# Altium schematic sheet UNOshield.SchDoc
size A4; SPICEModelCacheCSOAAMCO: <root> / <DocumentId>CSOAAMCO</DocumentId> / </root>
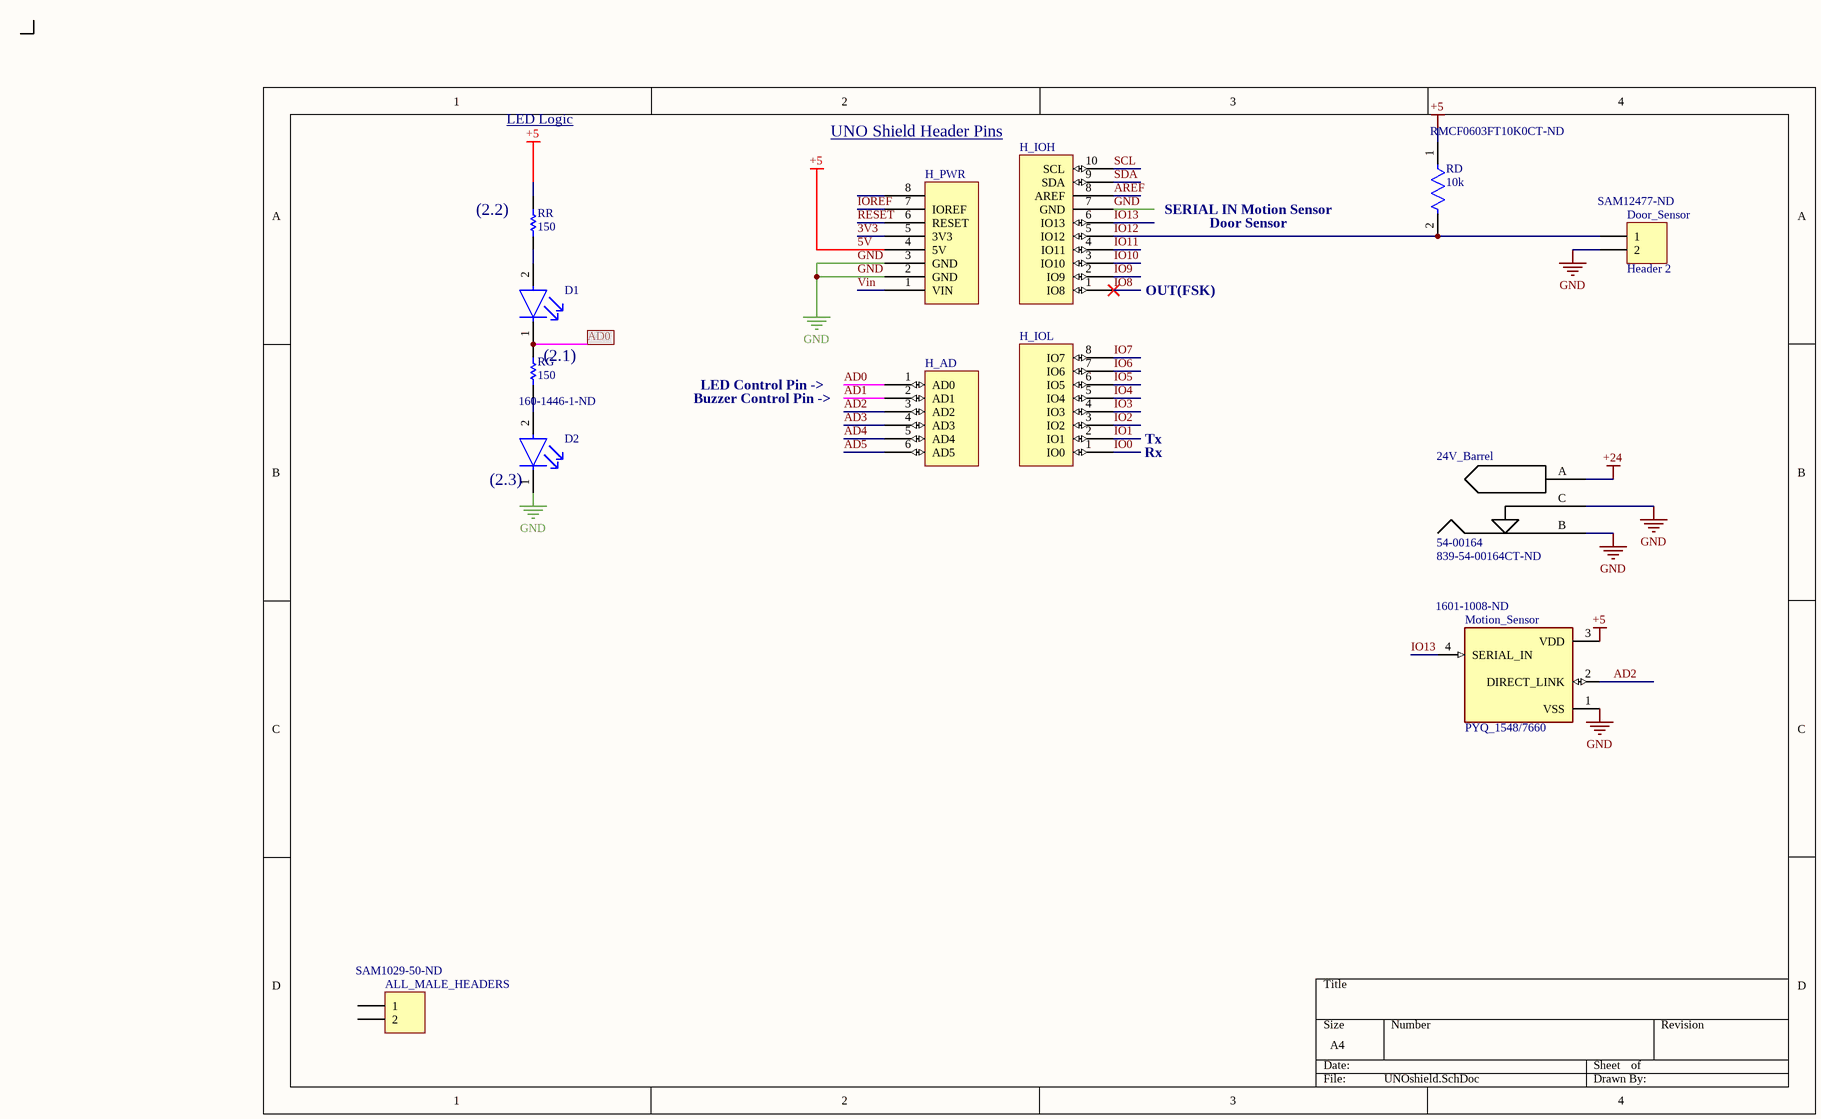
[diagram p0: UNOshield.SchDoc]

## Parts
24V_Barrel  54-00164  Supplier Part Number 1: 839-54-00164CT-ND  [54-00164]
ALL_MALE_HEADERS  Supplier Part Number 1: SAM1029-50-ND  [HDR1X2]  (mechanical)
D1  LS R976-NR-1  [FP-LS_R976-MFG]  (value not drawn)
D2  Supplier Part Number 1: 160-1446-1-ND  [FP-LTST-C191KGKT-MFG]  (hidden comment: LTST-C191KGKT)
Door_Sensor  Header 2  Supplier Part Number 1: SAM12477-ND  [HDR1X2]
H_AD  AD  [Header 6x1 8.5mm]  (value not drawn)
H_IOH  IOH  [Header 10x1 8.5mm]  (value not drawn)
H_IOL  IOL  [Header 8x1 8.5mm]  (value not drawn)
H_PWR  POWER_UNO  [Header 8x1 8.5mm]  (value not drawn)
Motion_Sensor  PYQ_1548/7660  Supplier Part Number 1: 1601-1008-ND  [TO254P940H440-4]
RD  10k  Supplier Part Number 1: RMCF0603FT10K0CT-ND  [FP-RC0603-0_55-IPC_C]
RG  value 150  [C0805]  (hidden comment: Res1)
RR  value 150  [C0805]  (hidden comment: Res1)

## Nets
5V: H_PWR.4(5V) Motion_Sensor.3(VDD) RD.1 RR.2  [also labelled +5]
+24: 24V_Barrel.A(Pin/Center)
GND: 24V_Barrel.B 24V_Barrel.C(Sheath/Outer) D2.1(C) Door_Sensor.2 H_IOH.7(GND) H_PWR.2(GND) H_PWR.3(GND) Motion_Sensor.1(VSS)
3V3: H_PWR.5(3V3)
AD0: D1.1(C) H_AD.1(AD0) RG.2
AD1: H_AD.2(AD1)
AD2: H_AD.3(AD2) Motion_Sensor.2(DIRECT_LINK)
AD3: H_AD.4(AD3)
AD4: H_AD.5(AD4)
AD5: H_AD.6(AD5)
AREF: H_IOH.8(AREF)
IO0: H_IOL.1(IO0)
IO1: H_IOL.2(IO1)
IO2: H_IOL.3(IO2)
IO3: H_IOL.4(IO3)
IO4: H_IOL.5(IO4)
IO5: H_IOL.6(IO5)
IO6: H_IOL.7(IO6)
IO7: H_IOL.8(IO7)
IO8: H_IOH.1(IO8)
IO9: H_IOH.2(IO9)
IO10: H_IOH.3(IO10)
IO11: H_IOH.4(IO11)
IO12: Door_Sensor.1 H_IOH.5(IO12) RD.2
IO13: H_IOH.6(IO13) Motion_Sensor.4(SERIAL_IN)
IOREF: H_PWR.7(IOREF)
RESET: H_PWR.6(RESET)
SCL: H_IOH.10(SCL)
SDA: H_IOH.9(SDA)
Vin: H_PWR.1(VIN)
NetD1_2: D1.2(A) RR.1
NetD2_2: D2.2(A) RG.1

Not connected (* = marked no-connect by the designer): ALL_MALE_HEADERS 1 2; H_PWR 8

## Notes on the sheet
- LED Logic
- UNO Shield Header Pins
- (near RR) (2.2)
- SERIAL IN Motion Sensor
- Door Sensor
- OUT(FSK)
- (near RG) (2.1)
- LED Control Pin ->
- Buzzer Control Pin ->
- Rx
- Tx
- (near D2) (2.3)

## Library data of the parts
24V_Barrel = 54-00164: Power Barrel Connector Jack 2.10mm ID (0.083"), 5.50mm OD (0.217") Surface Mount, Right Angle; Manufacturer: Tensility; Supplier 1: Digikey; Manufacturer Part Number: 54-00164; RoHS: No; Category: Connectors; Stock 1: 4776; Pricing 1: 1=0.86, 10=0.73, 25=0.684, 50=0.6514, 100=0.6202 (USD); ComponentLink1URL: http://www.tensility.com/pdffiles/54-00164.pdf?src-supplier=Digikey; ComponentLink1Description: http://www.tensility.com/pdffiles/54-00164.pdf?src-supplier=Digikey; ComponentLink2URL: https://datasheet.octopart.com/54-00164-Tensility-datasheet-189118339.pdf?src-supplier=Master+Electronics; ComponentLink2Description: https://datasheet.octopart.com/54-00164-Tensility-datasheet-189118339.pdf?src-supplier=Master+Electronics
ALL_MALE_HEADERS = Header 2: Board Connector, 50 Contact(s), 1 Row(s), Male, Straight, 0.1 inch Pitch, Solder Terminal, Black Insulator, Receptacle; Manufacturer: Samtec; Manufacturer Part Number: TSW-150-07-G-S; Option: General Purpose; Contact Pattern: RECTANGULAR; Contact Style: SQ PIN-SKT; Filter Feature: No; Number Of Connectors: 1; Number of Contacts: 50; Plating Thickness: 10uin; Reference Standard: UL; Reliability: COMMERCIAL; Supplier 1: Digikey; RoHS: Yes; Category: Connectors; Stock 1: 9225; Pricing 1: 1=2.96, 25=2.8564, 50=2.7206, 100=2.5281, 500=2.08774, 1000=1.74274, 2500=1.4559, 5000=1.18715 (USD); Mounting Technology: Board; Contact Material: Bronze; Contact Finish - Mating: GOLD (10); Contact Finish - Termination: Gold (Au) - with Nickel (Ni) barrier; Insulation Color: Black; Insulation Material: Glass; Connector Type: BOARD CONNECTOR; JESD-609 Code: e4; Body/Shell Style: RECEPTACLE; Contact Gender: Male; Mixed Contacts: No; Mounting Style: STRAIGHT; Number Of PCB Rows: 1; Number of Rows Loaded: 1; PCB Contact Pattern: RECTANGULAR; Termination: Solder; Body Breadth: 0.1inch; Body Depth: 0.1inch; Mating Contact Pitch: 0.1inch; Terminal Length: 0.1inch; Terminal Pitch: 2.54mm; Flammability Rating: UL94 V-0; DIN Conformance: No; IEC Conformance: No; MIL Conformance: No; Reach SVHC Compliant: Yes; RoHS Compliant: Yes; ComponentLink1URL: https://datasheet.ciiva.com:443/pdfs/VipMasterIC/IC/SAMI/SAMI-S-A0002522030/SAMI-S-A0002522030-1.pdf?src-supplier=IHS+Markit; ComponentLink1Description: https://datasheet.ciiva.com:443/pdfs/VipMasterIC/IC/SAMI/SAMI-S-A0002522030/SAMI-S-A0002522030-1.pdf?src-supplier=IHS+Markit; ComponentLink2URL: https://datasheet.ciiva.com/711/tsw-xxx-xx-xxx-x-xx-xxx-mkt-711590.pdf?src-supplier=Digikey; ComponentLink2Description: https://datasheet.ciiva.com/711/tsw-xxx-xx-xxx-x-xx-xxx-mkt-711590.pdf?src-supplier=Digikey; ComponentLink3URL: https://datasheet.ciiva.com/9712/htsw-th-9712215.pdf?src-supplier=Avnet; ComponentLink3Description: https://datasheet.ciiva.com/9712/htsw-th-9712215.pdf?src-supplier=Avnet
D1 = CMP-62016-000037-1: LED RED DIFFUSED 0805 SMD; Lens Size: 1.25mm; Number of LEDs: 1; Luminous Intensity: 180mcd; Dominant Wavelength: 633nm; Lens Style: Flat; Reverse Voltage: 12V; Lens Color: White; Forward Voltage: 2.5V; Forward Current: 25mA; Power Dissipation: 65W; Luminous Flux: 0.47lm; Test Current: 20mA; Viewing Angle: 160°; Length: 2mm; Number of Pins: 2; Lens Transparency: Diffused; Min Operating Temperature: -30°C; Case Code (Metric): 2012; Depth: 1.35mm; Color: Red; Illumination Color: Red; Max Operating Temperature: 85°C; Mount: Surface Mount; Case/Package: 0805; Height: 0.9mm; Package Quantity: 16000; Number of Elements: 1; Radiation Hardening: No; Case Code (Imperial): 0805; Packaging: Tape and Reel; Width: 1.25mm; Supplier 1: Digi-Key; Supplier Part Number 1: 475-LSR976-NR-1CT-ND
D2 = CMP-2000-05198-4: NexarPartId: 549907; Manufacturer: Vishay Lite-On; Forward Voltage: 2V; Viewing Angle: 130°; Lens Transparency: Clear; Power Rating: 75mW; Number of LEDs: 1; Luminous Intensity: 35mcd; Forward Current: 20mA; Dominant Wavelength: 571nm; Illumination Color: Green; Lens Color: Clear, Colorless; Reverse Voltage: 5V; Wavelength: 574nm; Description: Single Color LED, Ultra Bright Green, Water Clear, 1.1mm; Shape: Rectangular; Optoelectronic Device Type: SINGLE COLOR LED; Overall Height: 0.55mm; Number of Pins: 2; Packaging: Tape and Reel; Number of Elements: 1; Schedule B: 8541402000, 8541402000; Height: 550µm; Case/Package: 0603; Depth: 800µm; Max Operating Temperature: 85°C; RoHS: Compliant; Lens Style: Clear; Lead Free: Lead Free; Length: 1.6mm; Mount: Surface Mount; Test Current: 20mA; Width: 800µm; Case Code (Imperial): 0603; Min Operating Temperature: -55°C; Case Code (Metric): 1608; Radiation Hardening: No; Power Dissipation: 75mW; Color: Green; Supplier 1: Digikey; Manufacturer Part Number: LTST-C191KGKT; Stock 1: 1206866; Pricing 1: 1=0.15, 10=0.1, 100=0.0688, 500=0.05448, 1000=0.04972, 2000=0.04564, 5000=0.04116, 10000=0.03835, 15000=0.0369, 25000=0.03527, 35000=0.03429, 50000=0.03334, 125000=0.03124, 250000=0.02993 (USD); Mounting Technology: Surface Mount; Pins: 2; Color@wavelength: Green; Terminal Finish: Tin; JESD-609 Code: e3; Luminous Intensity-Nom: 35mcd; Channels: 1; Reverse Voltage-Max: 5V; Size: 1.1mm; Terminal Pitch: 1.5mm; Reach SVHC Compliant: Yes; RoHS Compliant: Yes; ComponentLink1URL: https://datasheet.ciiva.com:443/pdfs/VipMasterIC/IC/LITE/LITE-S-A0003156116/LITE-S-A0003156116-1.pdf?src-supplier=IHS+Markit; ComponentLink1Description: https://datasheet.ciiva.com:443/pdfs/VipMasterIC/IC/LITE/LITE-S-A0003156116/LITE-S-A0003156116-1.pdf?src-supplier=IHS+Markit; ComponentLink2URL: https://datasheet.ciiva.com/2109/ltst-c191kgkt-2109973.pdf?src-supplier=Digikey; ComponentLink2Description: https://datasheet.ciiva.com/2109/ltst-c191kgkt-2109973.pdf?src-supplier=Digikey
Door_Sensor = Header 2: Board Connector, 2 Contact(s), 1 Row(s), Female, Straight, 0.1 inch Pitch, Solder Terminal, Black Insulator, Socket; Manufacturer: Samtec; Manufacturer Part Number: CES-102-01-G-S; Option: General Purpose; Additional Feature: Low Profile; Contact Pattern: RECTANGULAR; Contact Resistance: 10mR; Contact Style: SQ PIN-SKT; Filter Feature: No; Insertion Force-Max: 2.224N; Mating Information: MULTIPLE MATING PARTS AVAILABLE; Number Of Connectors: 1; Polarization Key: POLARIZED HOUSING; Rated Current (Signal): 1A; Number of Contacts: 2; Withdrawl Force-Min: 1.112N; Body Breadth: 0.12inch; Body Depth: 0.2inch; Plating Thickness: 20uin; Reference Standard: UL; Reliability: COMMERCIAL; LatestRevisionDate: 17-Jul-2002; LatestRevisionNote: Re-released for DXP Platform.; Publisher: Altium Limited; Supplier 1: Digikey; RoHS: Yes; Category: Connectors; Stock 1: 5771; Pricing 1: 1=0.39, 10=0.329, 100=0.2797, 500=0.24966, 1000=0.23774, 5000=0.21221, 10000=0.20208 (USD); Mounting Technology: Board; Contact Finish - Mating: GOLD (30); Contact Finish - Termination: Gold (Au) - with Nickel (Ni) barrier; Insulation Color: Black; Insulation Material: Glass; Min Operating Temperature: -65°C; Max Operating Temperature: 125°C; Connector Type: BOARD CONNECTOR; JESD-609 Code: e4; Body/Shell Style: SOCKET; Contact Gender: Female; Mixed Contacts: No; Mounting Style: STRAIGHT; Number Of PCB Rows: 1; Number of Rows Loaded: 1; PCB Contact Pattern: RECTANGULAR; Termination: Solder; Body Length: 0.2inch; Mating Contact Pitch: 0.1inch; Terminal Length: 0.12inch; Terminal Pitch: 2.54mm; Flammability Rating: UL94 V-0; DIN Conformance: No; IEC Conformance: No; MIL Conformance: No; Reach SVHC Compliant: Yes; RoHS Compliant: Yes; ComponentLink1URL: https://datasheet.ciiva.com:443/pdfs/VipMasterIC/IC/SAMI/SAMI-S-A0000096262/SAMIS23449-1.pdf?src-supplier=IHS+Markit; ComponentLink1Description: https://datasheet.ciiva.com:443/pdfs/VipMasterIC/IC/SAMI/SAMI-S-A0000096262/SAMIS23449-1.pdf?src-supplier=IHS+Markit; ComponentLink2URL: http://www.farnell.com/datasheets/2045624.pdf?src-supplier=Farnell; ComponentLink2Description: http://www.farnell.com/datasheets/2045624.pdf?src-supplier=Farnell; ComponentLink3URL: http://suddendocs.samtec.com/prints/ces-1xx-xx-x-s-xx-mkt.pdf?src-supplier=Digikey; ComponentLink3Description: http://suddendocs.samtec.com/prints/ces-1xx-xx-x-s-xx-mkt.pdf?src-supplier=Digikey; ComponentLink4URL: http://www.samtec.com/documents/webfiles/pdf/CES.pdf?src-supplier=Avnet; ComponentLink4Description: http://www.samtec.com/documents/webfiles/pdf/CES.pdf?src-supplier=Avnet; ComponentLink5URL: https://datasheet.octopart.com/CES-102-01-G-S-Samtec-datasheet-62107104.pdf?src-supplier=Newark; ComponentLink5Description: https://datasheet.octopart.com/CES-102-01-G-S-Samtec-datasheet-62107104.pdf?src-supplier=Newark; ComponentLink6URL: https://datasheet.octopart.com/CES-102-01-G-S-Samtec-datasheet-130012063.pdf?src-supplier=Toby+Electronics; ComponentLink6Description: https://datasheet.octopart.com/CES-102-01-G-S-Samtec-datasheet-130012063.pdf?src-supplier=Toby+Electronics; ComponentLink7URL: https://datasheet.octopart.com/CES-102-01-G-S-Samtec-datasheet-151455179.pdf?src-supplier=Sager+Electronics; ComponentLink7Description: https://datasheet.octopart.com/CES-102-01-G-S-Samtec-datasheet-151455179.pdf?src-supplier=Sager+Electronics
Motion_Sensor = PYQ_1548/7660: Low Power Digipyro Motion Sens; Manufacturer: Excelitas; MF: Excelitas Technologies; MP: PYQ 1548/7660; Package: TO-5 Excelitas Technologies; Price: None; Availability: Unavailable; SnapEDA_Link: https://www.snapeda.com/parts/PYQ%201548/7660/Excelitas%20Technologies/view-part/4328334/?ref=snap; Value: *; Supplier 1: Digikey; Manufacturer Part Number: PYQ 1548/7660; RoHS: No; Stock 1: 7795; Pricing 1: 1=5.88 (USD); ComponentLink1URL: https://media.digikey.com/pdf/Data%20Sheets/Excelitas%20PDFs/PYQ_1548_7660_Apr17,2019_DS.pdf?src-supplier=Digikey; ComponentLink1Description: https://media.digikey.com/pdf/Data%20Sheets/Excelitas%20PDFs/PYQ_1548_7660_Apr17,2019_DS.pdf?src-supplier=Digikey
RD = CMP-2100-03664-2: RES 10K OHM 1% 1/10W 0603; Manufacturer: Stackpole Electronics; Manufacturer Part Number: RMCF0603FT10K0; Voltage Rating: 75V; Voltage Rating (DC): 50V; Resistance: 10kR; Power Rating: 100mW; Temperature Coefficient: 100ppm/°C; Description: Fixed Resistor, Metal Glaze/thick Film, 0.1W, 10000ohm, 75V, 1% +/-Tol, 100ppm/Cel, Surface Mount, 0603; Rated Temperature: 70°C; Value: 10kR; Temperature Coefficient (ppm/Cel): 100; Package Height: 0.45mm; Package Length: 1.55mm; Package Width: 0.8mm; Reference Standard: AEC-Q200; Depth: 0.8mm; Termination: SMD/SMT; Resistor Type: Thick Film; Series: RC; Construction: Rectangular; Features: Moisture Resistant; Packaging: Tape and Reel; Min Operating Temperature: -55°C; Number of Terminations: 2; Lead Pitch: 0.3mm; RoHS Compliant: Yes; Case/Package: 0603; Resistance Tolerance: 1%; Military Standard: Not; Weight: 7.1E-05oz; Number of Pins: 2; Tolerance: 1%; Length: 1.6mm; Case Code (Imperial): 0603; Lead Free: Lead Free; Width: 0.8mm; Max Power Dissipation: 100mW; Height: 0.45mm; Max Operating Temperature: 155°C; Case Code (Metric): 1608; Size Code: 0603; Supplier 1: Digikey; RoHS: Yes; Category: Chip SMD Resistors; Stock 1: 2923261; Pricing 1: 1=0.1, 10=0.02, 100=0.0091, 1000=0.0048, 2500=0.00386 (USD); Mounting Technology: Surface Mount; Pins: 2; Package Shape: Rectangular; Terminal Finish: Nickel; JESD-609 Code: e3; Power: 100mW; Technology: METAL GLAZE/THICK FILM; Working Voltage: 75V; Reach SVHC Compliant: Yes; ComponentLink1URL: https://datasheet.ciiva.com:443/pdfs/VipMasterIC/IC/SEIE/SEIE-S-A0009541969/SEIE-S-A0009541969-1.pdf?src-supplier=IHS+Markit; ComponentLink1Description: https://datasheet.ciiva.com:443/pdfs/VipMasterIC/IC/SEIE/SEIE-S-A0009541969/SEIE-S-A0009541969-1.pdf?src-supplier=IHS+Markit; ComponentLink2URL: http://components.arrow.com/part/dataview/43747082S6756917N1174?src-supplier=Arrow+Electronics; ComponentLink2Description: http://components.arrow.com/part/dataview/43747082S6756917N1174?src-supplier=Arrow+Electronics; ComponentLink3URL: https://www.seielect.com/catalog/SEI-RMCF_RMCP.pdf?src-supplier=Avnet; ComponentLink3Description: https://www.seielect.com/catalog/SEI-RMCF_RMCP.pdf?src-supplier=Avnet; ComponentLink4URL: https://www.seielect.com/catalog/sei-rmcf_rmcp.pdf?src-supplier=Digikey; ComponentLink4Description: https://www.seielect.com/catalog/sei-rmcf_rmcp.pdf?src-supplier=Digikey; ComponentLink5URL: http://www.seielect.com/catalog/sei-rmc.pdf?src-supplier=Future+Electronics; ComponentLink5Description: http://www.seielect.com/catalog/sei-rmc.pdf?src-supplier=Future+Electronics; ComponentLink6URL: https://datasheet.octopart.com/RMCF0603FT10K0-Stackpole-Electronics-datasheet-11547379.pdf?src-supplier=Future+Electronics; ComponentLink6Description: https://datasheet.octopart.com/RMCF0603FT10K0-Stackpole-Electronics-datasheet-11547379.pdf?src-supplier=Future+Electronics; ComponentLink7URL: https://www.verical.com/server-webapp/html/getDatasheet?partID=360913&src-supplier=Verical; ComponentLink7Description: https://www.verical.com/server-webapp/html/getDatasheet?partID=360913&src-supplier=Verical; ComponentLink8URL: https://datasheet.octopart.com/RMCF0603FT10K0-Stackpole-Electronics-datasheet-155966809.pdf?src-supplier=Electro+Sonic; ComponentLink8Description: https://datasheet.octopart.com/RMCF0603FT10K0-Stackpole-Electronics-datasheet-155966809.pdf?src-supplier=Electro+Sonic
RG RR = Res1: Fixed Resistor, Metal Glaze/thick Film, 0.125W, 150ohm, 150V, 1% +/-Tol, 100ppm/Cel, Surface Mount, 0805; Manufacturer: Yageo; Manufacturer Part Number: RC0805FR-07150RL; Additional Feature: LASER TRIMMABLE; Power: 125mW; Rated Temperature: 70°C; Temperature Coefficient (ppm/Cel): 100; Package Height: 0.5mm; Package Length: 2mm; Package Width: 1.25mm; Supplier 1: Digikey; Supplier Part Number 1: 311-150CRCT-ND; RoHS: Yes; Category: Chip SMD Resistors; Stock: 975966; Pricing: 1=0.1, 10=0.014, 100=0.0112, 1000=0.00918 (USD); Mounting Technology: Surface Mount; Pins: 2; Package Shape: Rectangular; Case/Package: 0805; Terminal Finish: Nickel; Min Operating Temperature: -55°C; Max Operating Temperature: 155°C; Tolerance: 1%; JESD-609 Code: e3; Resistor Type: FIXED RESISTOR; Construction: Chip; Packaging: Tape and Reel; Technology: METAL GLAZE/THICK FILM; Termination: Wraparound; Working Voltage: 150V; Reach SVHC Compliant: Yes; RoHS Compliant: Yes; ComponentLink1URL: https://datasheet.ciiva.com:443/pdfs/VipMasterIC/IC/YAGO/YAGO-S-A0008145938/YAGO-S-A0008145938-1.pdf?src-supplier=IHS+Markit; ComponentLink1Description: https://datasheet.ciiva.com:443/pdfs/VipMasterIC/IC/YAGO/YAGO-S-A0008145938/YAGO-S-A0008145938-1.pdf?src-supplier=IHS+Markit; ComponentLink2URL: https://datasheet.ciiva.com/11819/0900766b8106beab-11819782.pdf?src-supplier=Rs; ComponentLink2Description: https://datasheet.ciiva.com/11819/0900766b8106beab-11819782.pdf?src-supplier=Rs; ComponentLink3URL: https://datasheet.ciiva.com/2456/pyu-r-int-thick-7-2456999.pdf?src-supplier=Digikey; ComponentLink3Description: https://datasheet.ciiva.com/2456/pyu-r-int-thick-7-2456999.pdf?src-supplier=Digikey; ComponentLink4URL: https://datasheet.ciiva.com/2457/pyu-r-int-thick-7-2457000.pdf?src-supplier=Digikey; ComponentLink4Description: https://datasheet.ciiva.com/2457/pyu-r-int-thick-7-2457000.pdf?src-supplier=Digikey; ComponentLink5URL: https://datasheet.ciiva.com/2457/pyu-r-int-thick-7-2457001.pdf?src-supplier=Digikey; ComponentLink5Description: https://datasheet.ciiva.com/2457/pyu-r-int-thick-7-2457001.pdf?src-supplier=Digikey; ComponentLink6URL: https://datasheet.ciiva.com/7660/38627-7660798.pdf?src-supplier=Element14; ComponentLink6Description: https://datasheet.ciiva.com/7660/38627-7660798.pdf?src-supplier=Element14; ComponentLink7URL: https://datasheet.ciiva.com/46447/444164-46447566.pdf?src-supplier=Element14; ComponentLink7Description: https://datasheet.ciiva.com/46447/444164-46447566.pdf?src-supplier=Element14; ComponentLink8URL: https://datasheet.ciiva.com/12668/rc0805-12668251.pdf?src-supplier=Mouser; ComponentLink8Description: https://datasheet.ciiva.com/12668/rc0805-12668251.pdf?src-supplier=Mouser
H_AD = AD: Supplier 1: Arrow; Supplier Part Number 1: 2699089; Supplier 2: Digi-Key; Supplier Part Number 2: SAM1198-06-ND; Supplier 3: Arrow; Supplier Part Number 3: 2699088; Supplier 4: Arrow; Supplier Part Number 4: 2699075
H_IOH = IOH: Supplier 1: Arrow; Supplier Part Number 1: 2698803S4475693N1004; Supplier 2: Digi-Key; Supplier Part Number 2: SAM1198-10-ND; Supplier 3: Arrow; Supplier Part Number 3: 2698789
H_IOL = IOL: Supplier 1: Digi-Key; Supplier Part Number 1: SAM1198-08-ND; Supplier 2: Arrow; Supplier Part Number 2: 2698939; Supplier 3: Arrow; Supplier Part Number 3: 2698940; Supplier 4: Arrow; Supplier Part Number 4: 2698925
H_PWR = POWER_UNO: Supplier 1: Digi-Key; Supplier Part Number 1: SAM1198-08-ND; Supplier 2: Arrow; Supplier Part Number 2: 2698939; Supplier 3: Arrow; Supplier Part Number 3: 2698940; Supplier 4: Arrow; Supplier Part Number 4: 2698925